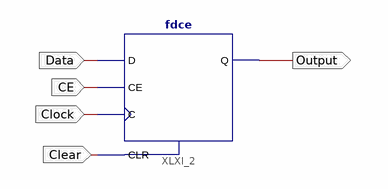
[diagram p0: schematic sheet 1]
// Xilinx ISE schematic SingleBitStorage.sch (virtex4) as structural Verilog: 1 symbols, 5 ports
module SingleBitStorage (
  input  Clear,
  input  CE,
  input  Clock,
  input  Data,
  output Output
);

  fdce XLXI_2 (.C(Clock), .CE(CE), .CLR(Clear), .D(Data), .Q(Output));
endmodule
